# Altium schematic sheet Buck_converter.SchDoc: DC DC converter
size A4; Author: Sajitha Madugalle; Revision: 1; SheetNumber: 7; SheetTotal: 9
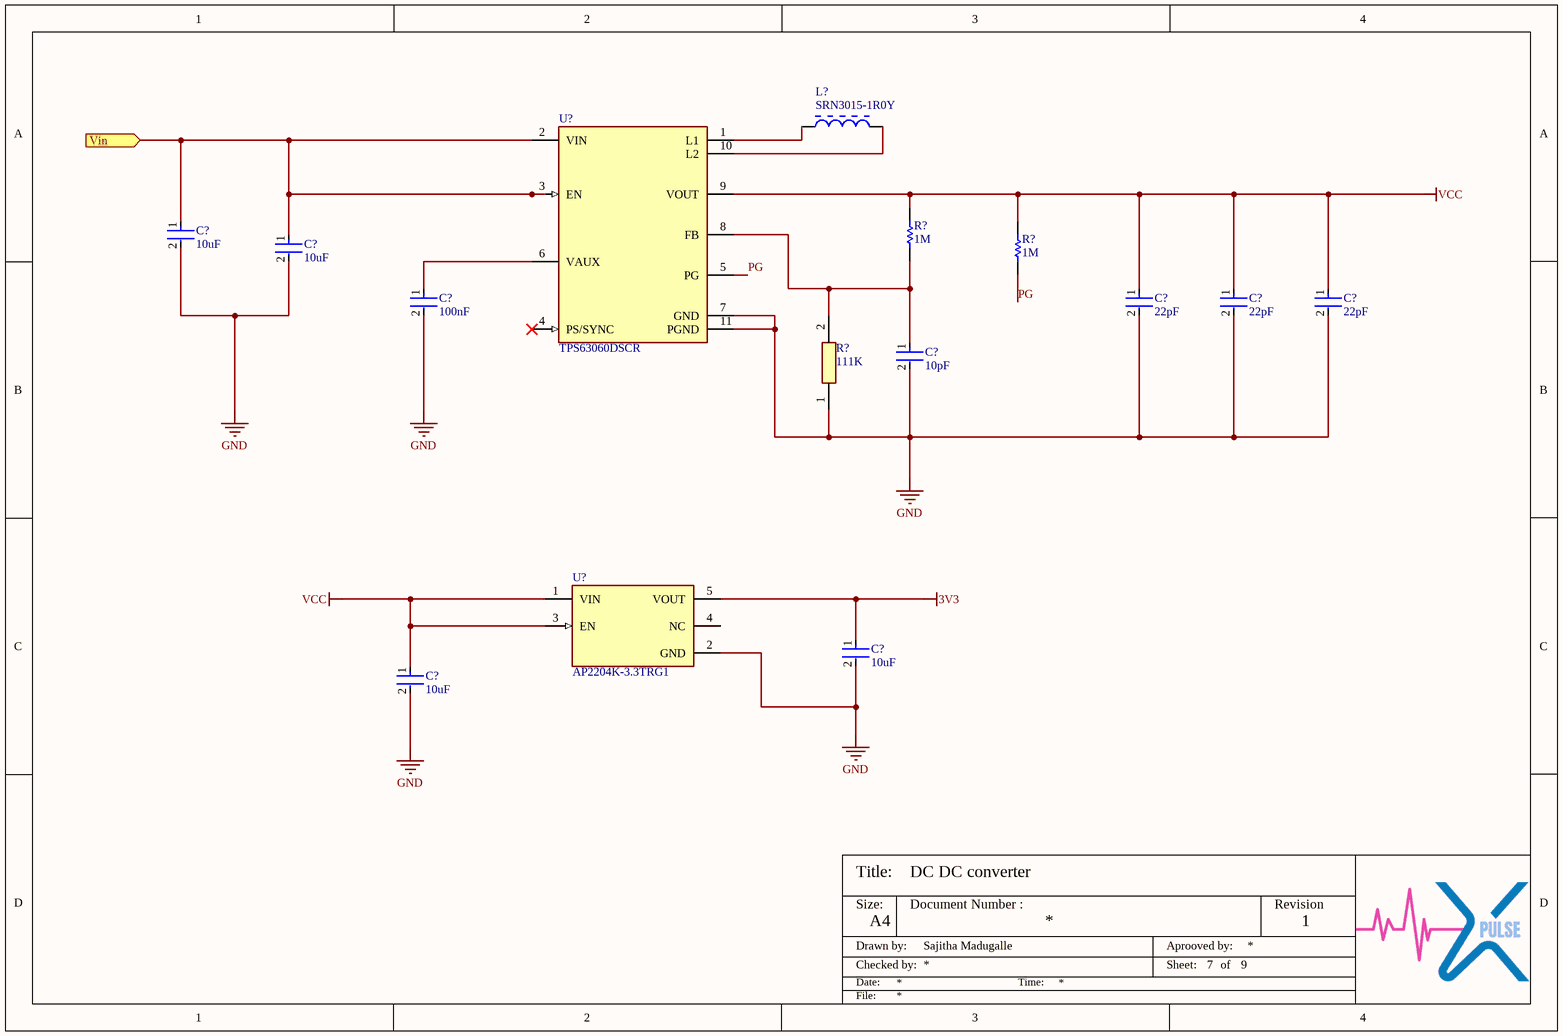
[diagram p0: Buck_converter.SchDoc]

## Parts
(Parts that share a designator on the sheet are numbered #1, #2 ... from top to bottom, then left to right.)
C?#1  10uF  [FP-GRM188-0_1-e0_2_0_55-IPC_A]
C?#2  10uF  [FP-GRM188-0_1-e0_2_0_55-IPC_A]
C?#3  100nF  [FP-CGA3E-0_3-0_1-IPC_A]
C?#4  22pF  [FP-C0603C-CF-MFG]
C?#5  22pF  [FP-C0603C-CF-MFG]
C?#6  22pF  [FP-C0603C-CF-MFG]
C?#7  10pF  [FP-C0603C-CF-MFG]
C?#8  10uF  [FP-CL10-IPC_A]
C?#9  10uF  [FP-CL10-IPC_A]
L?  SRN3015-1R0Y  [BOUR-SRN3015-2_V]
R?#1  1M  [RESC1608X55X25LL10T15]
R?#2  1M  [RESC1608X55X25LL10T15]
R?#3  111K  [RESC1608X55N]
U?#1  TPS63060DSCR  [FP-DSC0010G-MFG]
U?#2  AP2204K-3.3TRG1  [FP-SOT25-IPC_C]

## Ports
Vin (in)

## Nets
3V3: C?#8.1 U?#2.5(VOUT)
GND: C?#1.2 C?#2.2 C?#3.2 C?#4.2 C?#5.2 C?#6.2 C?#7.2 C?#8.2 C?#9.2 R?#3.1 U?#1.7(GND) U?#1.11(PGND) U?#2.2(GND)
VCC: C?#4.1 C?#5.1 C?#6.1 C?#9.1 R?#1.1 R?#2.1 U?#1.9(VOUT) U?#2.1(VIN) U?#2.3(EN)
PG: R?#2.2 U?#1.5(PG)
Vin: C?#1.1 C?#2.1 U?#1.2(VIN) U?#1.3(EN) ; port Vin
NetC?#3_1: C?#3.1 U?#1.6(VAUX)
NetC?#7_1: C?#7.1 R?#1.2 R?#3.2 U?#1.8(FB)
NetL?_1: L?.1 U?#1.1(L1)
NetL?_2: L?.2 U?#1.10(L2)

Not connected (* = marked no-connect by the designer): U?#1 4(PS/SYNC)*; U?#2 4(NC)

## Notes on the sheet
- Title:
- Size:
- Document Number :
- Revision
- Drawn by:
- Checked by:
- Date:
- A4
- Time:
- Aprooved by:
- Sheet:
- of
- File:

## Library data of the parts
C?#1 C?#2 = CMP-2006-02792-2: Chip Multilayer Ceramic Capacitors for General Purpose, 0603, 10uF, X5R, 15%, 20%, 6.3V; Packaging: Tape and Reel; Voltage Rating (DC): 6.3V; Width: 0.031inch; Termination: SMD/SMT; Dielectric: X5R; Package Quantity: 4000; Voltage Rating: 6.3V; Capacitance: 10uF; Case/Package: 0603; Min Operating Temperature: -55°C; Voltage: 6.3V; Length: 1.6mm; Thickness: 0.035inch; Lead Free: Lead Free; Depth: 0.8mm; Case Code (Imperial): 0603; Max Operating Temperature: 85°C; Material: Ceramic; Height: 0.8mm; Tolerance: 20%; Mount: Surface Mount; REACH SVHC: No SVHC; Radiation Hardening: No; Case Code (Metric): 1608
C?#3 = CMP-2000-07546-2: Cap Ceramic 100nF 50V X7R 10% Pad SMD 0603 +125°C Automotive T/R; Weight: 7.1E-05oz; Composition: Ceramic; Max Operating Temperature: 125°C; Termination: SMD/SMT; Dielectric: X7R; Length: 1.6mm; Package Quantity: 1; REACH SVHC: No SVHC; Lead Free: Lead Free; Case Code (Metric): 1608; Min Operating Temperature: -55°C; Packaging: Tape and Reel; Tolerance: 10%; Voltage Rating: 50V; Case Code (Imperial): 0603; Capacitance: 100nF; Case/Package: 0603; Voltage Rating (DC): 50V; Depth: 0.8mm; Radiation Hardening: No; Ratings: AEC-Q200; Mount: Surface Mount; Voltage: 50V; Thickness: 0.035inch; Width: 0.8mm; Height: 0.8mm
C?#4-C?#6 = CMP-2006-03119-3: Cap Ceramic 22pF 50V C0G 5% SMD 0603 125°C Paper T/R; Manufacturer Part Number: C0603C220J5GACTU; Manufacturer: KEMET; Description: C0603 22 pF C0G 30ppm/°C 5.00% 50 V; Temperature Coefficient: 30ppm/°C; Automotive Grade: Grade 1; Tolerance: 0.05; RoHS: TRUE; Temperature Characteristic: C0G; Capacitance: 22 pF; Device Class L3: Ceramic Capacitors; Digikey Description: Cap Ceramic 22pF 50V C0G 5% SMD 0603 125°C Paper T/R; ComponentLink2URL: https://api.kemet.com/component-edge/download/datasheet/C0603C100J5GACAUTO.pdf; ComponentLink2Description: Datasheet; Automotive: Yes; Temperature: -55°C to +125°C; Temperature Range High: +125°C; Package: C0603C-CF; Device Class L1: Passive Components; Device Class L2: Capacitors; Lead Free: Yes; Value: 22 pF; Category: Cap; Mouser Description: Cap Ceramic 22pF 50V C0G 5% SMD 0603 125°C Paper T/R; Voltage Rating: 50 V; Height: 0.87mm; Material: Ceramic; Temperature Range Low: -55°C; Octopart: https://octopart.com/c0603c220j5gactu-kemet-98525
C?#7 = CMP-2006-03343-2: CAP CER 10PF 50V NP0 0603; Manufacturer: KEMET; Manufacturer Part Number: C0603C100C5GACTU; Description: C0603 10 pF C0G 30ppm/°C 0.25 pF 50 V; Material: Ceramic; Temperature Coefficient: 30ppm/°C; Automotive Grade: Grade 1; Tolerance: 0.25 pF; Temperature Characteristic: C0G; Device Class L3: Ceramic Capacitors; Value: 10 pF; Device Class L1: Passive Components; Lead Free: Yes; RoHS: TRUE; Voltage Rating: 50 V; Automotive: Yes; Capacitance: 10 pF; Height: 0.87mm; Temperature Range Low: -55°C; Temperature Range High: +125°C; Mouser Description: Multilayer Ceramic Capacitors MLCC - SMD/SMT 50volts 10pF C0G 0.25%; Device Class L2: Capacitors; Digikey Description: CAP CER 10PF 50V NP0 0603; ComponentLink2Description: Datasheet; Package: C0603C-CF; ComponentLink2URL: https://api.kemet.com/component-edge/download/datasheet/C0603C100J5GACAUTO.pdf; Category: Cap; Octopart: https://octopart.com/c0603c100c5gactu-kemet-9138556; Temperature: -55°C to +125°C
C?#8 C?#9 = CMP-13271-000587-1: Cap Ceramic 100nF 50V X7R ±10% Pad SMD 0603 +125°C T/R; Case/Package: 0603; Depth: 0.8mm; Max Operating Temperature: 125°C; Lead Free: Lead Free; Material: Ceramic; Voltage Rating: 50V; Min Operating Temperature: -55°C; Voltage Rating (DC): 50V; Dielectric: X7R; Height: 0.8mm; Capacitance: 100nF; Thickness: 0.035inch; Radiation Hardening: No; Voltage: 50V; Packaging: Tape and Reel; Length: 1.6mm; Tolerance: 10%; Width: 0.031inch; Mount: Surface Mount; Package Quantity: 10000
L? = CMP-0007-00007-1: Semi-shielded Power Inductor, 1 uH, +/- 30%, 2.35 A, -40 to 125 degC, 3 x 3 x 1.5 mm SMD, RoHS and Halogen Free, Tape and Reel; Manufacturer: Bourns; Inductance tolerance: +/- 30%; DCR Max: 0.048 Ohm; Resistance to Solder Heat: +260 degC for 10 sec.; SRF Min: 145 MHz; Inductance: 1 uH; Isat: 2.35 A; ComponentLink3URL: http://www.bourns.com/data/global/pdfs/SRN3015.pdf; Packing: Tape and Reel; ComponentLink1Description: Manufacturer URL; DatasheetVersion: Aug-11; ComponentLink2URL: http://www.bourns.com/data/global/pdfs/SRN3015.pdf; PartNumber: SRN3015-1R0Y; ComponentLink3Description: Package Specification; RoHS: TRUE; Mounting Technology: Surface Mount; ComponentLink1URL: http://www.bourns.com/; Operating Temperature: -40 to 125 degC; Rated current: 2.35 A; PackageDescription: 2-Pin SMD, Body 3 x 3 mm, Height 1.5 mm; ComponentLink2Description: Datasheet; PackageReference: SRN3015
R?#1 R?#2 = CMP-1659-00056-1: Chip Resistor, 1 MOhm, +/- 1%, 100 mW, -55 to 155 degC, 0603 (1608 Metric), RoHS, Tape and Reel; Voltage Rating (DC): 25 V; Tolerance: 20%; Case\Package: Radial; Capacitance: 1 mF; Min Operating Temperature: -40 degC; PackageDescription: 2-Pin Surface Mount Device, Body 1.6 x 0.8 mm; ComponentLink1Description: Manufacturer URL; Radiation Hardening: No; DatasheetVersion: Rev. 4, 02/2016; REACH SVHC: No SVHC; Length: 20 mm; Max Operating Temperature: 85 degC; Diameter: 10 mm; Packaging: Bulk; Package Quantity: 200; PackageReference: 0603; Mount: Through Hole; ComponentLink1URL: http://www.yageo.com/; ComponentLink2URL: http://www.yageo.com/documents/recent/PYu-RC_Group_51_RoHS_L_04.pdf; ComponentLink2Description: Datasheet; Width: 0 inch; Lead Pitch: 5 mm; RoHSCompliant: true; Voltage Rating: 25 V; Height: 20 mm
R?#3 = RN73H1JTTD1113D25: Resistor; Manufacturer_Name: KOA Speer; Datasheet Link: https://www.mouser.com/datasheet/2/219/RN73H-12200.pdf; Height: 0.55mm; Manufacturer_Part_Number: RN73H1JTTD1113D25; Mouser Part Number: 660-RN73H1JTD1113D25; Mouser Price/Stock: https://www.mouser.co.uk/ProductDetail/KOA-Speer/RN73H1JTTD1113D25?qs=0hon8nwgHrb8JI0BK8RpbQ%3D%3D
U?#1 = CMP-04918-000043-1: IC REG BCK BST ADJ 2A 10WSON; Manufacturer: Texas Instruments; Description: Conv DC-DC 2.5V to 12V Step Down/Step Up Single-Out 2.5V to 8V 1A 10-Pin WSON EP T/R; Standoff Height: 0mm; Switching Frequency: 2400kHz; Min Supply Voltage: 2.5V; Number Of Outputs: 1; Output Voltage: 2.5-8V; Max Junction Temp: +125°C; Nominal Supply Current: 30uA; Output Type: AdjustableProgrammable; Output Current: 1A; Max Supply Voltage: 12V; Max Duty Cycle: 100%; Switching Topology: Buck-Boost; Octopart: https://octopart.com/tps63060dscr-texas+instruments-21396306; ComponentLink2Description: Datasheet; Category: IC; Ambient Temperature Range High: +85°C; Ipc Land Pattern Name: DFN300X300X70-10; Automotive: No; Manufacturer Part Number: TPS63060DSCR; Mouser Description: Voltage Regulators - Switching Regulators 2.5-12Vin,2.25A Sw Crnt Limit; Lead Free: Yes; Digikey Description: IC REG BCK BST ADJ 2A 10WSON; Device Class L3: Voltage Regulators - Switching; Ambient Temperature Range Low: -40°C; Temperature: -40°C to +85°C; Package: DSC0010G; Device Class L2: Power Management ICs; Device Class L1: Integrated Circuits (ICs); ComponentLink2URL: http://www.ti.com/lit/ds/symlink/tps63060.pdf; Temperature Range High: +85°C; Height: 0.8mm; RoHS: TRUE; Temperature Range Low: -40°C
U?#2 = CMP-2000-05782-2: IC REG LINEAR 3.3V 150MA SOT23-5; Max Input Voltage: 24V; Min Input Voltage: 2.3V; Quiescent Current: 50uA; Number of Regulators: 1; Max Output Current: 250mA; Reference Voltage: 1.24V; Output Type: Fixed; Polarity: Positive; Dropout Voltage: 360mV; Weight: 0.001058oz; Min Operating Temperature: -40°C; Output Current: 150mA; Lead Free: Lead Free; Length: 3.02mm; Height: 1.3mm; Width: 1.7mm; Case/Package: SOT-23-5; Max Operating Temperature: 85°C; Package Quantity: 3000; Mount: Surface Mount; Output Voltage: 3.3V; Number of Pins: 5; Packaging: Tape and Reel; Number of Outputs: 1